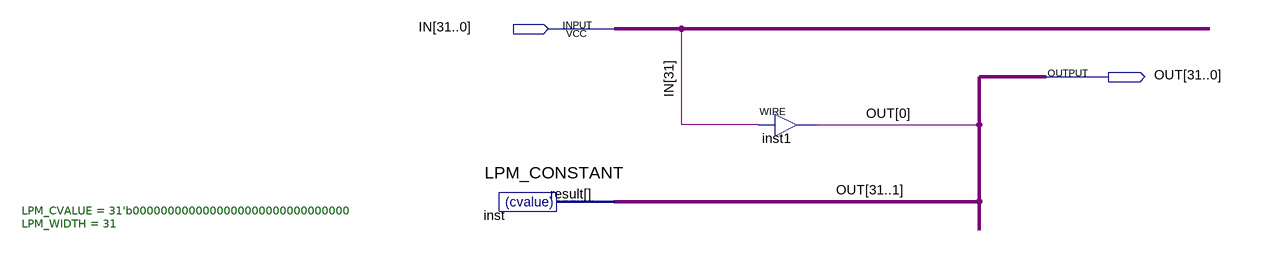
[diagram p0: schematic sheet]
// Quartus schematic zeroextend.bdf as structural Verilog: 2 symbols, 2 pins
module zeroextend (
  input  [31:0] IN,
  output [31:0] OUT
);

  LPM_CONSTANT #(.LPM_CVALUE(31'b0000000000000000000000000000000), .LPM_WIDTH(31)) inst (.result(OUT[31:1]));
  assign OUT[0] = IN[31];  // WIRE inst1
endmodule
